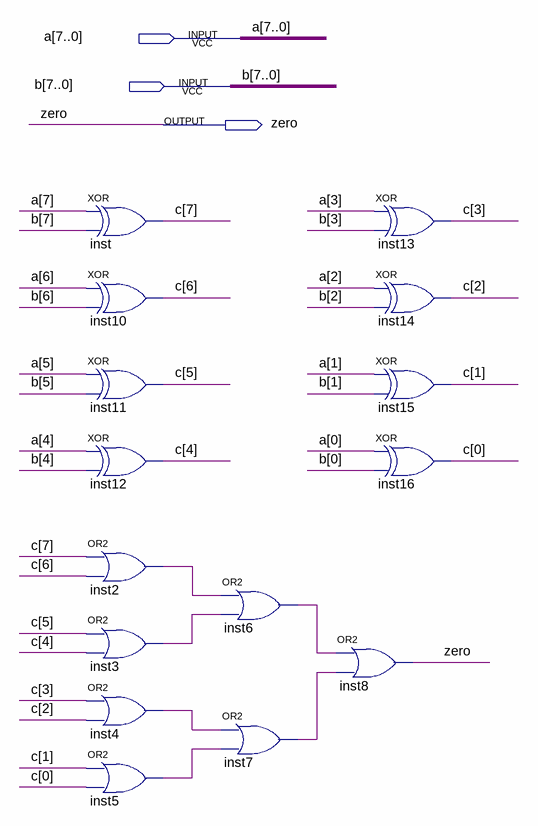
[diagram p0: schematic sheet]
// Quartus schematic nEqual8bit.bdf as structural Verilog: 15 symbols, 3 pins
module nEqual8bit (
  input  [7:0] a,
  input  [7:0] b,
  output zero
);

  wire inst2_out, inst3_out, inst4_out, inst5_out, inst6_out, inst7_out;
  wire [7:0] c;

  xor inst (c[7], a[7], b[7]);
  xor inst10 (c[6], a[6], b[6]);
  xor inst11 (c[5], a[5], b[5]);
  xor inst12 (c[4], a[4], b[4]);
  or inst2 (inst2_out, c[7], c[6]);
  or inst3 (inst3_out, c[5], c[4]);
  or inst4 (inst4_out, c[3], c[2]);
  or inst5 (inst5_out, c[1], c[0]);
  or inst6 (inst6_out, inst2_out, inst3_out);
  or inst7 (inst7_out, inst4_out, inst5_out);
  xor inst13 (c[3], a[3], b[3]);
  xor inst14 (c[2], a[2], b[2]);
  xor inst15 (c[1], a[1], b[1]);
  xor inst16 (c[0], a[0], b[0]);
  or inst8 (zero, inst6_out, inst7_out);
endmodule
